# EAGLE design Ammeter (EAGLE 6.2)
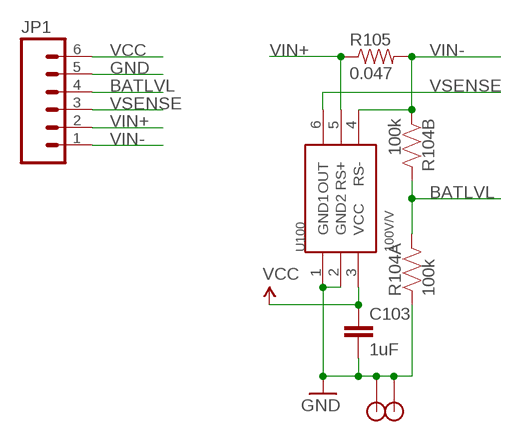
[diagram p0: schematic, sheet 1]

## Parts
C103  1uF  CAP0402-CAP  [0402-CAP]
JP1  M06SIP  [1X06]
R104  100k  RP2EXB24V  [CRA02]
R105  0.047  RESISTOR0402-RES  [0402-RES]
U100  100V/V  MAX4173  [SOT-23-6]
U$1  STANDOFF  [STANDOFF]
U$2  STANDOFF  [STANDOFF]

## Nets
BATLVL: JP1.4 R104.3 R104.4
GND: C103.2 JP1.5 R104.1 U100.1(GND1) U100.2(GND2) U$1.P$1 U$2.P$1
VCC: C103.1 JP1.6 U100.3(VCC)
VIN+: JP1.2 R105.1 U100.5(RS+)
VIN-: JP1.1 R104.2 R105.2 U100.4(RS-)
VSENSE: JP1.3 U100.6(OUT)

## Library data of the parts
C103 = SparkFun:CAP: Capacitor Standard 0603 ceramic capacitor, and 0.1" leaded capacitor.; DIGIKEY: 445-1415-1-ND
JP1 = SparkFun-Connectors:M06: Header 6 Standard 6-pin 0.1" header. Use with straight break away headers (SKU : PRT-00116), right angle break away headers (PRT-00553), swiss pins (PRT-00743), machine pins (PRT-00117), and female headers (PRT-00115). Molex polarized connector foot print use with SKU : PRT-08094 with associated crimp pins and housings. NOTES ON THE VARIANTS LOCK and LOCK_LONGPADS... This footprint was designed to help hold the alignment of a through-hole component (i.e. 6-pin header) while soldering it into place. You may notice that each hole has been shifted either up or down by 0.005 of an inch from it's more standard position (which is a perfectly straight line). This slight alteration caused the pins (the squares in the middle) to touch the edges of the holes. Because they are alternating, it causes a "brace" to hold the component in place. 0.005 has proven to be the perfect amount of "off-center" position when using our standard breakaway headers. Although looks a little odd when you look at the bare footprint, once you have a header in there, the alteration is very hard to notice. Also,if you push a header all the way into place, it is covered up entirely on the bottom side. This idea of altering the position of holes to aid alignment will be further integrated into the Sparkfun Library for other footprints. It can help hold any component with 3 or more connection pins.
R104 = KwanSystems:RP2
R105 = SparkFun:RESISTOR: Resistor Basic schematic elements and footprints for 0603, 1206, and PTH resistors.; DIGIKEY: P.047ATCT-ND
U100 = KwanSystems:MAX4173; DIGIKEY: MAX4173HEUT+TCT-ND
U$1 U$2 = KwanSystems:STANDOFF

## Net classes
0 default: width 0.152 mm, drill 0.33 mm, clearance 0.152 mm

## Board
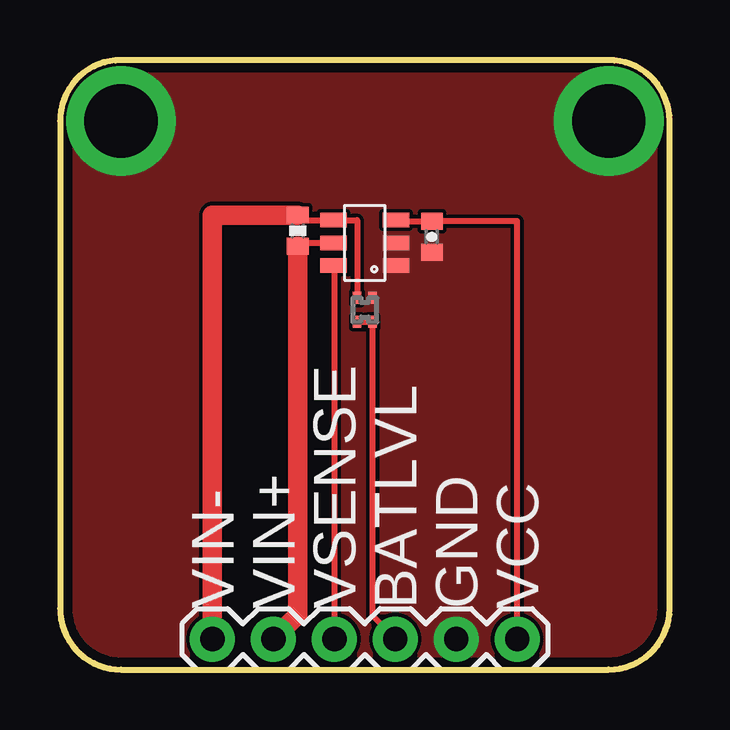
[diagram p1: board, top side]
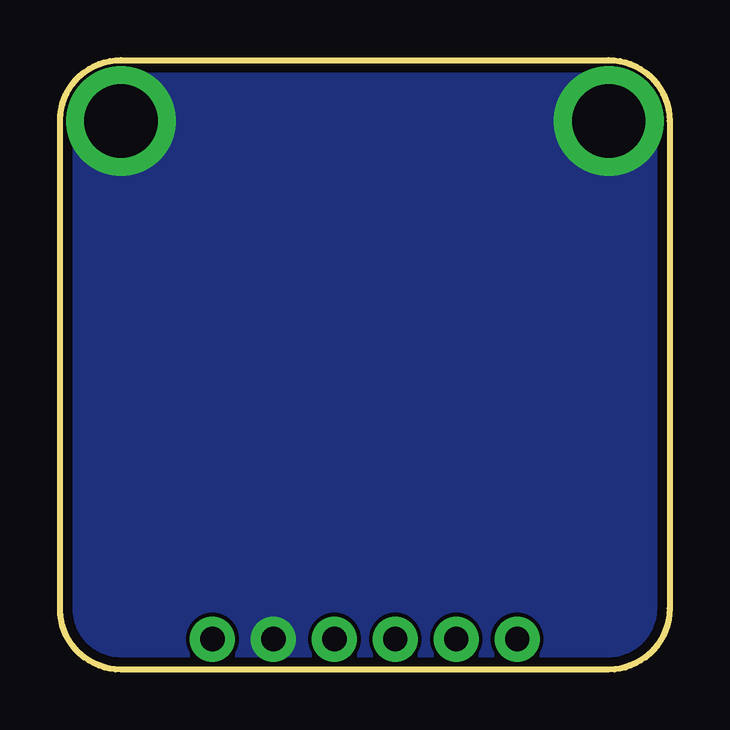
[diagram p2: board, bottom side, seen from below]

Size 25.4 x 25.4 mm. Coordinates in mm from the lower left corner, seen from the top.
Outline: 2.54,0 22.86,0 arc90 25.4,2.54 25.4,22.86 arc90 22.86,25.4 2.54,25.4 arc90 0,22.86 0,2.54 arc90 2.54,0
Copper layers (1*16): Top 0.0356mm / dielectric 1.5011mm / Bottom 0.0356mm
Design rules: minimum track width 6mil, minimum drill 13mil, track to track 6mil, track to pad 6mil, pad to pad 6mil, via to via 6mil, smd to smd 6mil, copper to edge 15mil, drill to drill 6mil, minimum pad ring 7mil, minimum via ring 7mil, stop-mask expansion 4mil, vias tented up to drill 0mil, thermal gap 10mil

### Footprints (pad centres in the part's own frame; a part is rotated, then mirrored left to right if it is on the bottom)
0402-CAP = smd 0.7 x 0.9: 1 -0.65,0; 2 0.65,0
1X06 = drill 1.016 pad 1.88: 1 0,0; 2 2.54,0; 3 5.08,0; 4 7.62,0; 5 10.16,0; 6 12.7,0
CRA02 = smd 0.35 x 0.5: 1 -0.325,-0.5; 2 0.325,-0.5; 3 0.325,0.5; 4 -0.325,0.5
0402-RES = smd 0.7 x 0.9: 1 -0.65,0; 2 0.65,0
SOT-23-6 = smd 0.6 x 1.1: 1 -0.95,-1.3; 2 0,-1.3; 3 0.95,-1.3; 4 0.95,1.3; 5 0,1.3; 6 -0.95,1.3
STANDOFF = drill 3.048 pad 4.572: P$1 0,0

### Placement (x,y rotation side)
C103  15.49,18.03 270 top
JP1  6.35,1.27 0 top
R104  12.7,14.99 180 top
R105  9.91,18.29 90 top
U100  12.7,17.78 90 top
U$1  2.54,22.86 0 top
U$2  22.86,22.86 0 top

### Tracks (layer width: path | path; a pad name or v marks a point on that pad's centre or on a via)
BATLVL
  Top 0.254: R104.3 R104.4 13.03,2.21 JP1.4
GND
  pour Top (no thermals): 2.54,25.4 22.86,25.4 arc-90 25.4,22.86 25.4,2.54 arc-90 22.86,0 2.54,0 arc-90 0,2.54 0,22.86 arc-90
  pour Bottom (no thermals): 2.54,25.4 22.86,25.4 arc-90 25.4,22.86 25.4,2.54 arc-90 22.86,0 2.54,0 arc-90 0,2.54 0,22.86 arc-90
VCC
  Top 0.254: U100.3 14.05,18.68 C103.1 19.05,18.68 JP1.6
VIN+
  Top 0.254: R105.1 10.05,17.78 U100.5
  Top 0.813: JP1.2 9.91,2.29 R105.1
VIN-
  Top 0.254: R104.2 12.38,18.73 U100.4 9.95,18.73 R105.2
  Top 0.813: R105.2 6.35,18.94 JP1.1
VSENSE
  Top 0.254: U100.6 11.43,16.8 JP1.3

### Text on the board
tPlace: VIN- | VIN+ | VSENSE | BATLVL | GND | VCC